# EAGLE design Freescale_Dev_2G (EAGLE 5.08)
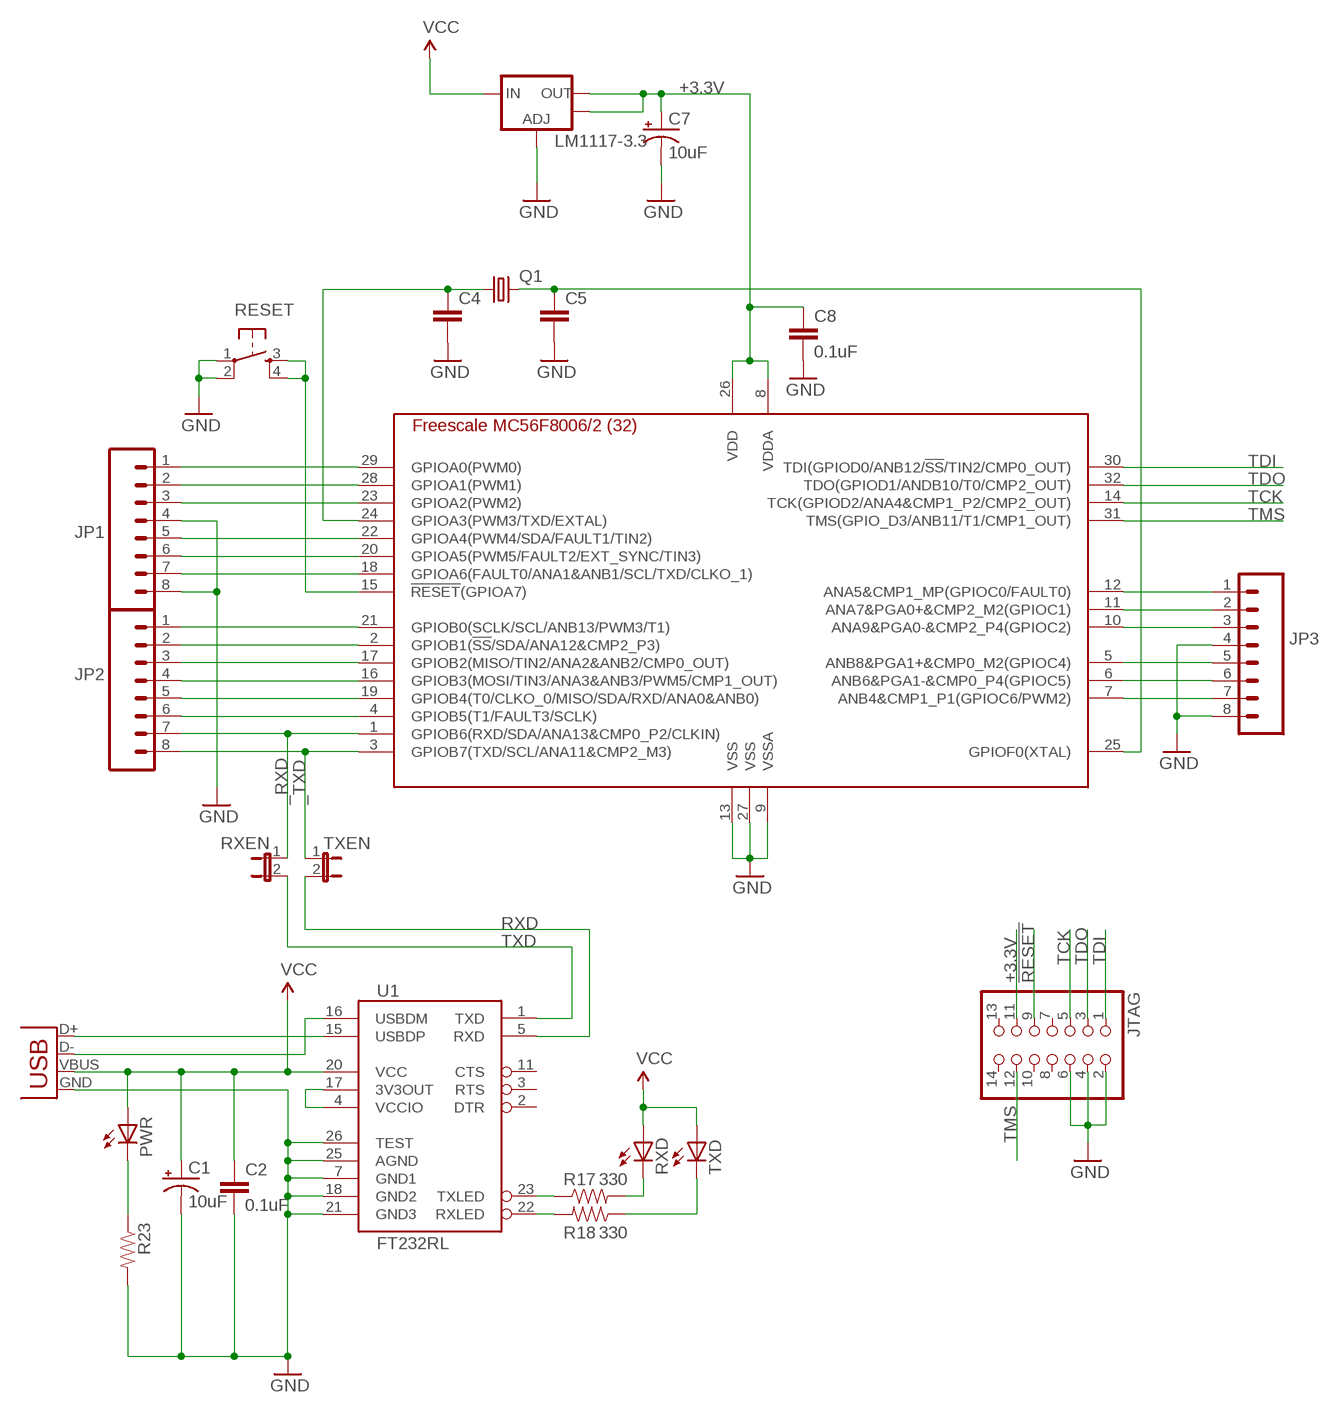
[diagram p0: schematic, sheet 1]

## Parts
C1  10uF  CAP_POL1206  [EIA3216]
C2  0.1uF  CAP0603-CAP  [0603-CAP]
C4  CAP0805  [0805]
C5  CAP0805  [0805]
C7  10uF  CAP_POL1206  [EIA3216]
C8  0.1uF  CAP0603-CAP  [0603-CAP]
JP1  M08LOCK  [1X08_LOCK]
JP2  M08LOCK  [1X08_LOCK]
JP3  M08LOCK  [1X08_LOCK]
JTAG  PINHD-2X7  [2X07]
LM1117-3.3  V_REG_LM1117SOT223  [SOT223]
PWR  LED1206  [LED-1206]
Q1  CRYSTALHC49UV  [HC49U-V]
R17  330  RESISTOR  [0805]
R18  330  RESISTOR  [0805]
R23  RESISTOR  [0805]
RESET  TAC_SWITCHPTH  [TACTILE-PTH]
RXD  LED1206  [LED-1206]
RXEN  JUMPER-2PTH_LOCK  [1X02_LOCK]
TXD  LED1206  [LED-1206]
TXEN  JUMPER-2PTH_LOCK  [1X02_LOCK]
U1  FT232RL  FT232RL-BASICSSOP  [SSOP28DB]
U$1  MC56F8006VLC  [TQFP32-08]
X1  USBSMD  [USB-MINIB]

## Nets
!RESET: JTAG.9 RESET.3 RESET.4 U$1.15(!RESET!(GPIOA7))
+3.3V: C7.A(+) C8.1 JTAG.11 LM1117-3.3.2(OUT) LM1117-3.3.4(OUT) U$1.8(VDDA) U$1.26(VDD)
_RXD: JP2.7 RXEN.1 U$1.1(GPIOB6(RXD/SDA/ANA13&CMP0_P2/CLKIN))
_TXD: JP2.8 TXEN.1 U$1.3(GPIOB7(TXD/SCL/ANA11&CMP2_M3))
GND: C1.C(-) C2.2 C4.2 C5.2 C7.C(-) C8.2 JP1.4 JP1.8 JP3.4 JP3.8 JTAG.2 JTAG.4 JTAG.6 LM1117-3.3.1(ADJ) R23.2 RESET.1 RESET.2 U1.7(GND1) U1.18(GND2) U1.21(GND3) U1.25(AGND) U1.26(TEST) U$1.9(VSSA) U$1.13(VSS) U$1.27(VSS) X1.GND
HSYNC: JP3.1 U$1.12(ANA5&CMP1_MP(GPIOC0/FAULT0))
N$9: JP1.7 U$1.18(GPIOA6(FAULT0/ANA1&ANB1/SCL/TXD/CLKO_1))
N$12: PWR.C R23.1
N$13: JP3.3 U$1.10(ANA9&PGA0-&CMP2_P4(GPIOC2))
N$14: JP3.6 U$1.6(ANB6&PGA1-&CMP0_P4(GPIOC5))
N$15: JP3.5 U$1.5(ANB8&PGA1+&CMP0_M2(GPIOC4))
N$16: JP2.5 U$1.19(GPIOB4(T0/CLKO_0/MISO/SDA/RXD/ANA0&ANB0))
N$17: JP2.6 U$1.4(GPIOB5(T1/FAULT3/SCLK))
N$20: JP1.1 U$1.29(GPIOA0(PWM0))
N$21: JP1.2 U$1.28(GPIOA1(PWM1))
N$27: JP2.1 U$1.21(GPIOB0(SCLK/SCL/ANB13/PWM3/T1))
N$28: JP2.2 U$1.2(GPIOB1(!SS!/SDA/ANA12&CMP2_P3))
N$29: JP2.3 U$1.17(GPIOB2(MISO/TIN2/ANA2&ANB2/CMP0_OUT))
N$30: JP2.4 U$1.16(GPIOB3(MOSI/TIN3/ANA3&ANB3/PWM5/CMP1_OUT))
N$32: C5.1 Q1.2 U$1.25(GPIOF0(XTAL))
N$38: R17.2 RXD.C
N$39: R18.1 TXD.C
N$40: R17.1 U1.23(TXLED)
N$41: R18.2 U1.22(RXLED)
N$42: U1.4(VCCIO) U1.17(3V3OUT)
N$43: U1.16(USBDM) X1.D-
N$44: U1.15(USBDP) X1.D+
N$48: JP1.3 U$1.23(GPIOA2(PWM2))
N$49: JP3.7 U$1.7(ANB4&CMP1_P1(GPIOC6/PWM2))
N$50: C4.1 Q1.1 U$1.24(GPIOA3(PWM3/TXD/EXTAL))
N$51: JP1.5 U$1.22(GPIOA4(PWM4/SDA/FAULT1/TIN2))
N$52: JP1.6 U$1.20(GPIOA5(PWM5/FAULT2/EXT_SYNC/TIN3))
RXD: TXEN.2 U1.5(RXD)
TCK: JTAG.5 U$1.14(TCK(GPIOD2/ANA4&CMP1_P2/CMP2_OUT))
TDI: JTAG.1 U$1.30(TDI(GPIOD0/ANB12/!SS!/TIN2/CMP0_OUT))
TDO: JTAG.3 U$1.32(TDO(GPIOD1/ANDB10/T0/CMP2_OUT))
TMS: JTAG.12 U$1.31(TMS(GPIO_D3/ANB11/T1/CMP1_OUT))
TXD: RXEN.2 U1.1(TXD)
VCC: C1.A(+) C2.1 LM1117-3.3.3(IN) PWR.A RXD.A TXD.A U1.20(VCC) X1.VBUS
VSYNC: JP3.2 U$1.11(ANA7&PGA0+&CMP2_M2(GPIOC1))
Unconnected: JTAG.7 JTAG.8 JTAG.10 JTAG.13 JTAG.14 U1.2(DTR) U1.3(RTS) U1.11(CTS)

## Library data of the parts
C1 C7 = SparkFun:CAP_POL: Capacitor Polarized These are standard SMD and PTH capacitors. Normally 10uF, 47uF, and 100uF in electrolytic and tantalum varieties. Always verify the external diameter of the through hole cap, it varies with capacity, voltage, and manufacturer. The EIA devices should be standard.
C2 C4 C5 C8 = SparkFun:CAP: Capacitor Standard 0603 ceramic capacitor, and 0.1" leaded capacitor.
JP1-JP3 = SparkFun:M08: Header 8 Standard 8-pin 0.1" header. Use with straight break away headers (SKU : PRT-00116), right angle break away headers (PRT-00553), swiss pins (PRT-00743), machine pins (PRT-00117), and female headers (PRT-00115).
JTAG = pinhead:PINHD-2X7: PIN HEADER
LM1117-3.3 = SparkFun:V_REG_LM1117: Voltage Regulator LM1117 Standard adjustable voltage regulator but in SMD form. Spark Fun Electronics SKU : COM-00595
PWR RXD TXD = SparkFun:LED: LEDs Standard schematic elements and footprints for 5mm, 3mm, 1206, and 0603 sized LEDs. 5mm - Spark Fun Electronics SKU : COM-00529 (and others)
Q1 = SparkFun:CRYSTAL: Crystals Various standard crystals. Proven footprints. Spark Fun Electronics SKU : COM-00534
R17 R18 R23 = SparkFun:RESISTOR: Resistor Basic schematic elements and footprints for 0603, 1206, and PTH 1/10th watt (small) resistors.
RESET = SparkFun:TAC_SWITCH: Momentary Switch Button commonly used for reset or general input. Spark Fun Electronics SKU : COM-00097
RXEN TXEN = SparkFun:JUMPER-2: Jumper Basic 0.1" spaced jumper. Use with breakaway headers.
U1 = SparkFun:FT232RL-BASIC: USB UART This is the simplified version of the FT232RL unit. Only what you need, nothing you don't. Spark Fun Electronics SKU : COM-00650
U$1 = Atari:MC56F8006VLC: MC56F800x: MC56F8006 and MCF56F8002 Digital Signal Controllers <https://www.freescale.com/webapp/sps/site/prod_summary.jsp?code=MC56F800x> The devices in the MC56F8006 series are members of Freescale's family of digital signal controllers (DSCs). The entry-level MC56F8006/2 DSC provides the most cost-optimized solution for mathematically-intensive, power-sensitive real-time control applications.
X1 = SparkFun:USB: USB Connectors USB-B-PTH is fully proven SKU : PRT-00139 USB-miniB is fully proven SKU : PRT-00587 USB-A-PCB is untested. USB-A-H is throughly reviewed, but untested. Spark Fun Electronics SKU : PRT-00437 USB-B-SMT is throughly reviewed, but untested. Needs silkscreen touching up. USB-A-S has not been used/tested USB-MB-H has not been used/tested

## Board
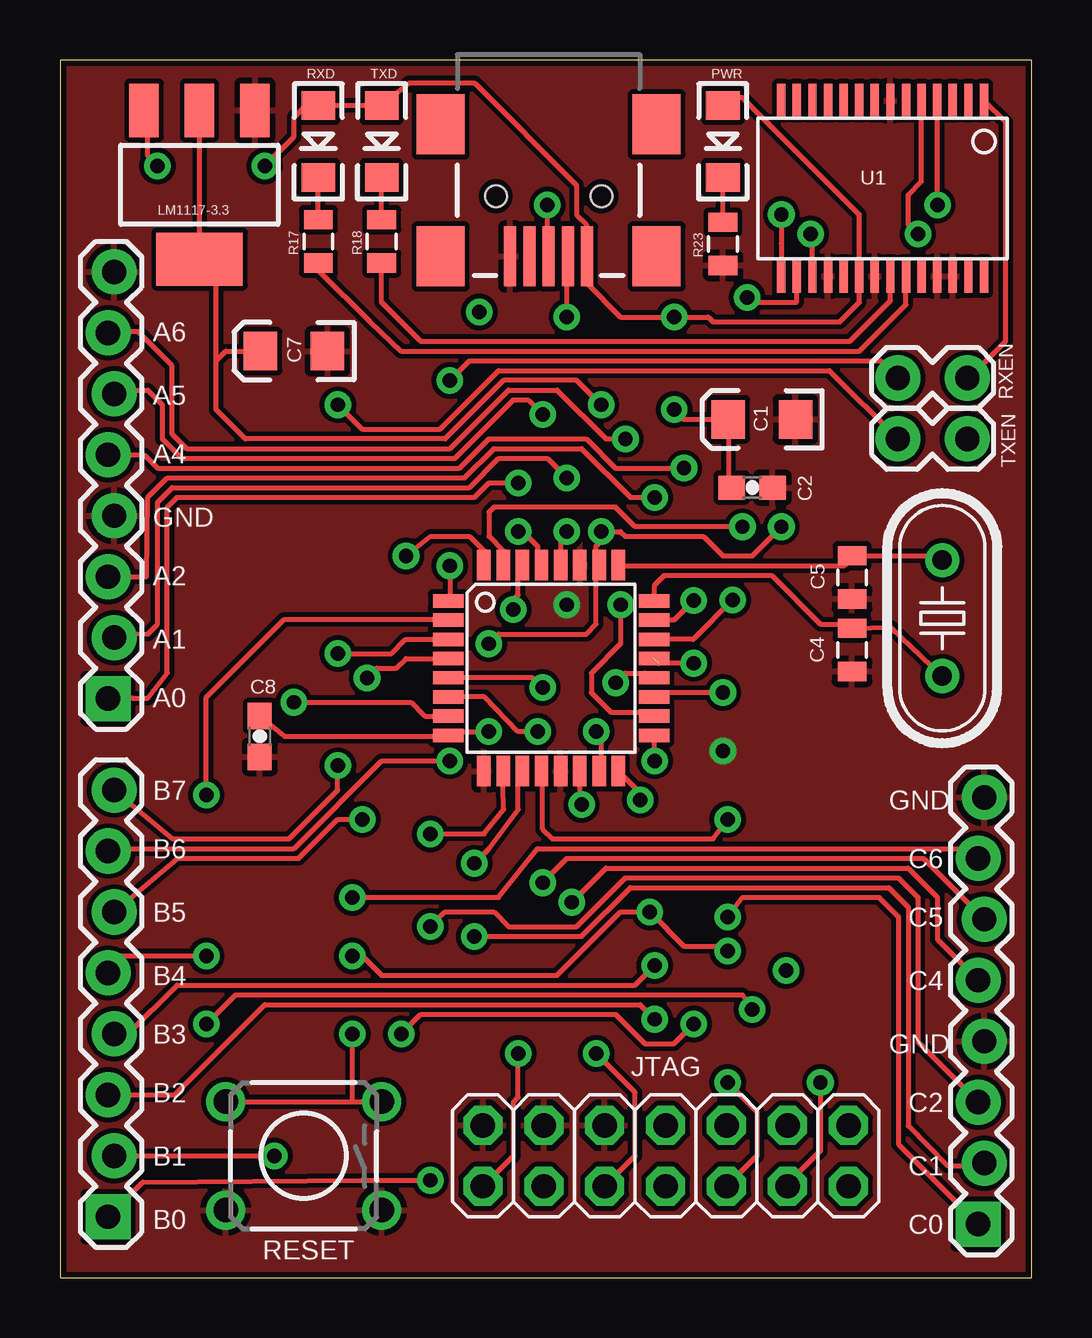
[diagram p1: board, top side]
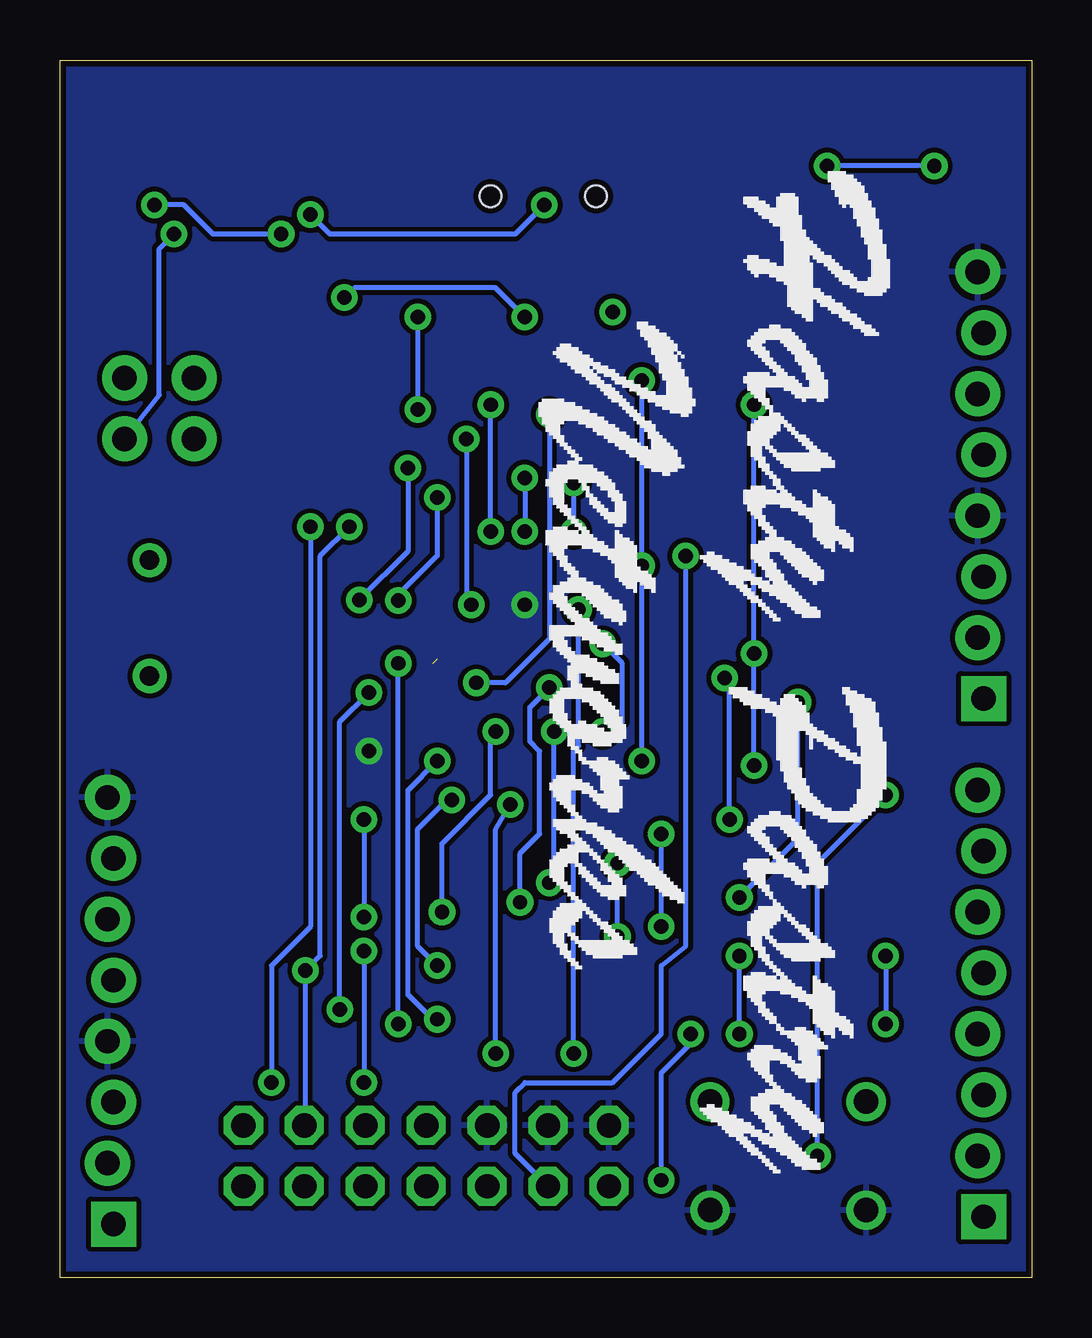
[diagram p2: board, bottom side, seen from below]

Size 40.51 x 50.74 mm. Coordinates in mm from the lower left corner, seen from the top.
Outline: 0,0 40.51,0 40.51,50.74 0,50.74 0,0
Copper layers (1*16): Top 0.035mm / dielectric 1.5mm / Bottom 0.035mm
Design rules "SparkFun": minimum track width 8mil, minimum drill 20mil, track to track 8mil, track to pad 8mil, pad to pad 8mil, via to via 8mil, smd to smd 8mil, copper to edge 10mil, drill to drill 8mil, minimum pad ring 12mil, minimum via ring 10mil, stop-mask expansion 4mil, vias tented up to drill 25mil, thermal gap 10mil

### Footprints (pad centres in the part's own frame; a part is rotated, then mirrored left to right if it is on the bottom)
EIA3216 = smd 1.4 x 1.6: A 1.4,0; C -1.4,0
0603-CAP = smd 1.1 x 1: 1 -0.85,0; 2 0.85,0
0805 = smd 0.8 x 1.2: 1 -0.9,0; 2 0.9,0
1X08_LOCK = drill 1.016 pad 1.88 square: 1 0,0.127 | drill 1.016 pad 1.88 round: 2 2.54,-0.127; 3 5.08,0.127; 4 7.62,-0.127; 5 10.16,0.127; 6 12.7,-0.127; 7 15.24,0.127; 8 17.78,-0.127
2X07 = drill 1.016 octagon: 1 -7.62,-1.27; 2 -7.62,1.27; 3 -5.08,-1.27; 4 -5.08,1.27; 5 -2.54,-1.27; 6 -2.54,1.27; 7 0,-1.27; 8 0,1.27; 9 2.54,-1.27; 10 2.54,1.27; 11 5.08,-1.27; 12 5.08,1.27; 13 7.62,-1.27; 14 7.62,1.27
SOT223 = smd 1.219 x 2.235: 1 -2.311,-3.099; 2 0,-3.099; 3 2.311,-3.099 | smd 3.6 x 2.2: 4 0,3.099
LED-1206 = smd 1.2 x 1.4: A -1.5,0; C 1.5,0
HC49U-V = drill 0.813 round: 1 -2.413,0; 2 2.413,0
TACTILE-PTH = drill 1.016 round: 1 -3.251,2.261; 2 3.251,2.261; 3 -3.251,-2.261; 4 3.251,-2.261
1X02_LOCK = drill 1.016 pad 1.88 round: 1 -0.178,0; 2 2.718,0
SSOP28DB = smd 0.348 x 1.397: 1 -4.225,-3.656; 2 -3.575,-3.656; 3 -2.925,-3.656; 4 -2.275,-3.656; 5 -1.625,-3.656; 6 -0.975,-3.656; 7 -0.325,-3.656; 8 0.325,-3.656; 9 0.975,-3.656; 10 1.625,-3.656; 11 2.275,-3.656; 12 2.925,-3.656; 13 3.575,-3.656; 14 4.225,-3.656; 15 4.225,3.656; 16 3.575,3.656; 17 2.925,3.656; 18 2.275,3.656; 19 1.625,3.656; 20 0.975,3.656; 21 0.325,3.656; 22 -0.325,3.656; 23 -0.975,3.656; 24 -1.625,3.656; 25 -2.275,3.656; 26 -2.925,3.656; 27 -3.575,3.656; 28 -4.225,3.656
TQFP32-08 = smd 1.27 x 0.559: 1 -4.293,2.8; 2 -4.293,2; 3 -4.293,1.2; 4 -4.293,0.4; 5 -4.293,-0.4; 6 -4.293,-1.2; 7 -4.293,-2; 8 -4.293,-2.8; 17 4.293,-2.8; 18 4.293,-2; 19 4.293,-1.2; 20 4.293,-0.4; 21 4.293,0.4; 22 4.293,1.2; 23 4.293,2; 24 4.293,2.8 | smd 0.559 x 1.27: 9 -2.8,-4.293; 10 -2,-4.293; 11 -1.2,-4.293; 12 -0.4,-4.293; 13 0.4,-4.293; 14 1.2,-4.293; 15 2,-4.293; 16 2.8,-4.293; 25 2.8,4.293; 26 2,4.293; 27 1.2,4.293; 28 0.4,4.293; 29 -0.4,4.293; 30 -1.2,4.293; 31 -2,4.293; 32 -2.8,4.293
USB-MINIB = smd 2.5 x 0.5: D+ 2.5,0; D- 2.5,0.8; GND 2.5,-1.6; ID 2.5,-0.8; VBUS 2.5,1.6 | smd 2.5 x 2: GND@1 -3,-4.5; GND@2 -3,4.5; GND@3 2.5,4.5; GND@4 2.5,-4.5 | hole 0.9: 0,2.2; 0,-2.2

### Placement (x,y rotation side)
C1  29.26,35.76 180 top
C2  28.85,32.92 0 top
C4  33.02,26.16 270 top
C5  33.02,29.18 270 top
C7  9.75,38.61 180 top
C8  8.33,22.56 270 top
JP1  2.13,24.13 90 top
JP2  2.13,2.54 90 top
JP3  38.4,2.24 90 top
JTAG  25.25,5.08 0 top
LM1117-3.3  5.82,45.54 180 top
PWR  27.64,47.35 270 top
Q1  36.78,27.48 90 top
R17  10.77,43.18 90 top
R18  13.41,43.18 270 top
R23  27.64,43.08 270 top
RESET  10.16,5.08 180 top
RXD  10.77,47.35 270 top
RXEN  35.1,37.49 0 top
TXD  13.41,47.35 270 top
TXEN  35.1,34.95 0 top
U1  34.29,45.39 180 top
U$1  20.47,25.4 0 top
U$2  [HP_LOGO_SM]  13.82,24.79 270 bottom
X1  20.37,45.06 270 top

### Tracks (layer width: path | path; a pad name or v marks a point on that pad's centre or on a via)
!RESET  (via drill 0.6)
  Top 0.203: RESET.4 12.19,7.34 | 12.19,7.34 RESET.3 | U$1.15 22.55,21.23 22.55,22.55 v22.35,22.76 | v12.19,13.41 12.6,13.41 13.41,12.6 20.73,12.6 23.37,15.24 v24.59,15.24 26.01,13.82 27.64,13.82 v27.84,13.61 | 12.19,7.34 v12.19,10.16 | JTAG.9 29.06,5.08 29.06,6.91 v27.84,8.13
  Bottom 0.203: v22.35,22.76 22.55,22.55 22.55,20.12 24.59,18.09 v24.59,15.24 | v12.19,10.16 v12.19,13.41 | v27.84,13.61 v27.84,8.13
+3.3V  (via drill 0.6)
  Top 0.203: v17.88,26.42 18.29,26.82 21.95,26.82 22.35,27.23 22.35,29.67 U$1.26 22.35,29.81 22.35,30.48 22.55,30.68 v22.55,31.09 23.37,31.09 23.57,30.89 26.82,30.89 27.64,30.07 28.85,30.07 v30.07,31.29 | LM1117-3.3.2 LM1117-3.3.4 6.4,41.86 6.5,41.86 6.5,38.2 | v22.55,36.37 21.54,37.39 18.49,37.39 16.05,34.95 7.72,34.95 6.5,36.17 6.5,38.2 | v17.88,22.76 16.26,22.76 U$1.8 arc-90 16.14,22.55 9.35,22.55 C8.1 | C7.A 6.91,38.61 6.5,38.2 | JTAG.11 30.33,3.91 31.7,5.28 v31.7,8.13
  Bottom 0.203: v17.88,22.76 17.48,22.76 17.07,23.16 17.07,25.6 v17.88,26.42 | v22.55,31.09 v22.55,36.37 | v30.07,31.29 30.07,14.63 31.7,13.01 v31.7,8.13
_RXD  (via drill 0.6)
  Top 0.203: JP2.7 2.52,17.88 9.75,17.88 13.41,21.54 v16.26,21.54 | 16.26,28.28 U$1.1 16.02,28.2 16.26,28.37 v16.26,29.67 | v16.26,37.39 17.07,38.2 34.21,38.2 RXEN.1
  Bottom 0.203: v16.26,21.54 v16.26,29.67 v16.26,37.39
_TXD  (via drill 0.6)
  Top 0.203: v11.58,26.01 13.82,26.01 14.41,26.6 U$1.3 | JP2.8 4.7,18.29 9.55,18.29 11.58,20.32 v11.58,21.34 | TXEN.1 32.08,37.8 18.29,37.8 15.85,35.36 12.6,35.36 v11.58,36.37
  Bottom 0.203: v11.58,21.34 v11.58,26.01 v11.58,36.37
GND  (via drill 0.6)
  other vias: 21.13,28.04 27.64,21.95
  pour Top: 0,50.55 40.44,50.55 40.44,0 0,0
  pour Bottom: 0.41,50.8 40.64,50.8 40.64,0 0,0 0,50.8
HSYNC  (via drill 0.6)
  Top 0.203: JP3.1 34.95,5.56 34.95,15.04 34.14,15.85 28.45,15.85 v27.84,15.04 | v27.84,19.1 27.23,18.29 20.52,18.29 20.12,18.69 20.12,21.06 U$1.12
  Bottom 0.203: v27.84,19.1 v27.84,15.04
N$4  (via drill 0.6)
  other vias: 17.48,40.23
N$9  (via drill 0.6)
  Top 0.203: JP1.7 2.44,39.42 3.25,39.42 4.67,38 4.67,35.15 5.28,34.54 16.26,34.54 18.69,36.98 20.73,36.98 22.76,34.95 v23.57,34.95 | U$1.18 24.38,23.57 22.96,23.57 22.15,24.38 22.15,25.2 23.37,26.42 v23.37,28.04
  Bottom 0.203: v23.57,34.95 23.57,28.45 23.37,28.25 v23.37,28.04
N$12
  Top 0.203: R23.1 PWR.C
N$13  (via drill 0.6)
  Top 0.203: JP3.3 35.76,9.83 35.76,15.85 34.95,16.66 23.57,16.66 21.54,14.63 18.69,14.63 18.09,15.24 16.05,15.24 v15.44,14.63 | U$1.10 18.47,20.5 18.49,19.51 17.68,18.49 v15.44,18.49
  Bottom 0.203: v15.44,14.63 v15.44,18.49
N$14  (via drill 0.6)
  Top 0.203: U$1.6 17.7,24.2 19.1,22.76 v19.91,22.76 | JP3.6 35.99,17.48 21.13,17.48 v20.12,16.46
  Bottom 0.203: v20.12,16.46 19.91,16.66 v19.91,22.76
N$15  (via drill 0.6)
  Top 0.203: U$1.5 17.67,25 19.71,24.99 v20.12,24.59 | JP3.5 36.58,14.1 36.58,15.85 35.36,17.07 22.76,17.07 v21.34,15.65
  Bottom 0.203: v21.34,15.65 21.34,17.68 20.52,18.49 20.52,21.95 20.93,22.35 20.93,23.77 v20.12,24.59
N$16  (via drill 0.6)
  Top 0.203: U$1.19 24.95,24.38 v27.64,24.38 | v6.1,13.41 2.52,13.41 JP2.5 | v6.1,10.57 7.32,11.79 28.45,11.79 v28.85,11.18
  Bottom 0.203: v28.85,11.18 28.85,23.16 v27.64,24.38 | v6.1,13.41 v6.1,10.57
N$17  (via drill 0.6)
  Top 0.203: JP2.6 4.9,17.48 9.96,17.48 11.58,19.1 v12.6,19.1 | v12.8,24.99 13.21,25.4 14.02,25.4 14.42,25.8 U$1.4
  Bottom 0.203: v12.6,19.1 12.6,24.79 v12.8,24.99
N$20  (via drill 0.6)
  Top 0.203: JP1.1 2.44,24.38 3.02,24.16 3.66,24.16 4.47,25.2 4.47,32.11 4.88,32.51 17.27,32.51 17.88,33.12 v19.1,33.12 | v19.1,31.09 19.3,31.09 19.91,30.48 19.91,29.85 U$1.29
  Bottom 0.203: v19.1,33.12 v19.1,31.09
N$21  (via drill 0.6)
  Top 0.203: JP1.2 2.85,26.85 3.66,26.82 4.06,27.23 4.06,32.31 4.67,32.92 17.07,32.92 18.29,34.14 20.32,34.14 v21.13,33.33 | v21.13,31.09 21.13,30.89 20.87,30.63 U$1.28
  Bottom 0.203: v21.13,33.33 v21.13,31.09
N$27  (via drill 0.6)  (1 unrouted)
  Top 0.203: JP2.1 3.45,3.99 12.6,4.06 v15.44,4.06 | v14.22,10.16 15.04,10.97 23.16,10.97 24.38,9.75 25.6,9.75 v26.42,10.57 | v26.42,25.6 24.96,25.6
  Bottom 0.203: v15.44,4.06 15.44,8.53 14.22,9.75 v14.22,10.16 | v26.42,10.57 v26.42,25.6
N$28  (via drill 0.6)
  Top 0.203: JP2.2 v8.94,5.08 | v6.1,20.12 6.1,24.18 9.35,27.43 16.15,27.43 arc-90 U$1.2
  Bottom 0.203: v8.94,5.08 8.94,17.27 v6.1,20.12
N$29  (via drill 0.6)
  Top 0.203: v24.79,21.54 24.79,22.57 U$1.17 | JP2.3 4.78,7.62 8.53,11.38 24.18,11.38 v24.79,10.77
  Bottom 0.203: v24.79,10.77 25.2,10.97 26.01,11.79 26.01,20.32 v24.79,21.54
N$30  (via drill 0.6)
  Top 0.203: v24.79,13.01 23.98,12.19 4.88,12.19 2.85,10.16 JP2.4 | U$1.16 24.18,20.2 v24.18,19.91
  Bottom 0.203: v24.79,13.01 25.6,13.82 25.6,18.69 24.38,19.91 v24.18,19.91
N$32
  Top 0.203: U$1.25 23.3,29.67 32.72,29.67 33.11,30.07 C5.1 36.59,30.09 Q1.2
N$38
  Top 0.203: R17.2 RXD.C
N$39
  Top 0.203: R18.1 TXD.C
N$40
  Top 0.203: U1.23 35.27,40.55 33.33,38.61 14.22,38.61 12.92,39.83 10.77,41.98 R17.1
N$41
  Top 0.203: R18.2 13.41,40.64 15.04,39.01 32.92,39.01 34.62,40.71 U1.22
N$42  (via drill 0.6)
  Top 0.203: U1.4 36.58,49.03 v36.58,44.7 | v31.29,43.48 31.36,43.15 U1.17
  Bottom 0.203: v31.29,43.48 34.14,43.48 35.36,44.7 v36.58,44.7
N$43  (via drill 0.6)
  Top 0.203: v21.13,40.03 21.13,42.52 X1.D- | v28.65,40.84 28.85,40.64 30.68,40.64 30.71,40.67 U1.16
  Bottom 0.203: v21.13,40.03 22.35,41.25 28.25,41.25 v28.65,40.84
N$44  (via drill 0.6)
  Top 0.203: v20.32,44.7 20.32,42.51 X1.D+ | v30.07,44.3 30.07,43.09 U1.15
  Bottom 0.203: v20.32,44.7 21.54,43.48 29.26,43.48 v30.07,44.3
N$48  (via drill 0.6)
  Top 0.203: v24.79,32.51 23.77,32.51 21.74,34.54 18.09,34.54 16.87,33.33 4.47,33.33 3.66,32.51 3.61,29.21 JP1.3 | U$1.23 25.6,27.4 v26.42,28.21
  Bottom 0.203: v24.79,32.51 24.79,30.07 26.42,28.45 v26.42,28.21
N$49  (via drill 0.6)
  Top 0.203: U$1.7 15.21,23.4 14.63,23.98 v9.75,23.98 | v12.19,15.85 18.29,15.85 19.91,17.88 37.87,17.88 JP3.7
  Bottom 0.203: v9.75,23.98 9.75,18.29 v12.19,15.85
N$50
  Top 0.203: U$1.24 24.79,28.23 24.79,28.85 25.2,29.26 29.67,29.26 31.7,27.23 32.88,27.23 C4.1 34.63,27.1 Q1.1
N$51  (via drill 0.6)
  Top 0.203: v26.01,33.73 23.16,33.73 21.95,34.95 17.88,34.95 16.66,33.73 4.06,33.73 3.5,34.29 JP1.5 | v28.04,28.25 26.4,26.6 U$1.22
  Bottom 0.203: v26.01,33.73 26.01,30.28 v28.04,28.25
N$52  (via drill 0.6)
  Top 0.203: v20.12,35.97 19.51,36.58 18.9,36.58 16.46,34.14 5.08,34.14 4.27,34.95 4.27,36.37 3.66,36.98 2.85,36.98 JP1.6 | v23.16,24.79 23.57,25.2 24.38,25.2 U$1.20
  Bottom 0.203: v20.12,35.97 20.12,26.62 21.95,24.79 v23.16,24.79
RXD  (via drill 0.6)
  Top 0.203: U1.5 35.91,45.67 35.36,45.11 35.36,43.89 v35.76,43.48
  Bottom 0.203: TXEN.2 36.37,36.78 36.37,42.88 v35.76,43.48
TCK  (via drill 0.6)
  Top 0.203: U$1.14 21.67,19.78 v21.74,19.71 | v22.35,9.35 23.98,7.72 23.98,5.08 JTAG.5
  Bottom 0.203: v21.74,19.71 22.35,18.69 v22.35,9.35
TDI  (via drill 0.6)
  Top 0.203: U$1.30 19.1,29.52 19.1,28.45 18.9,28.25 v18.9,27.84 | v19.1,9.35 19.1,7.52 18.9,7.32 18.9,5.08 JTAG.1
  Bottom 0.203: v18.9,27.84 18.9,22.15 19.1,21.95 v19.1,9.35
TDO  (via drill 0.6)
  Top 0.203: U$1.32 17.67,30.28 17.07,30.89 15.44,30.89 v14.43,30.07
  Bottom 0.203: v14.43,30.07 14.43,13.82 15.44,13.01 15.44,10.16 17.48,8.13 21.13,8.13 21.54,7.72 21.54,5.18 JTAG.3
TMS  (via drill 0.6)
  Top 0.203: U$1.31 18.47,30.3 17.88,30.89 17.88,31.9 18.09,32.11 23.16,32.11 23.98,31.29 v28.45,31.29
  Bottom 0.203: v28.45,31.29 29.67,30.07 29.67,13.41 30.07,13.01 v30.28,12.8 30.28,6.4 JTAG.12
TXD
  Top 0.203: U1.1 39.42,48.14 39.42,39.01 38.51,38.1 RXEN.2
VCC  (via drill 0.6)
  Top 0.203: LM1117-3.3.3 3.66,48.49 3.66,46.74 v4.06,46.33 | v8.53,46.33 9.75,47.55 9.75,48.36 10.54,49.15 RXD.A TXD.A 14.55,49.78 17.27,49.78 21.54,45.52 21.54,44.3 21.95,43.89 21.95,42.53 | PWR.A 27.64,49.17 28.45,49.17 33.33,44.3 33.33,41.74 U1.20 33.33,41.72 33.33,40.64 32.51,39.83 27.23,39.83 27.03,40.03 v25.6,40.03 23.37,40.03 21.95,41.45 21.95,42.53 | v25.6,36.17 26.01,35.76 C1.A 27.86,33.06 C2.1 | 21.95,42.53 X1.VBUS
  Bottom 0.203: v4.06,46.33 v8.53,46.33 | v25.6,40.03 v25.6,36.17
VSYNC  (via drill 0.6)
  Top 0.203: JP3.2 38.43,4.67 36.98,4.67 35.36,6.33 35.36,15.44 34.54,16.26 23.77,16.26 21.74,14.22 v17.27,14.22 | v17.27,17.27 17.88,17.88 19.1,19.51 19.1,20.73 19.27,20.9 U$1.11
  Bottom 0.203: v17.27,14.22 v17.27,17.27

### Text on the board
tPlace: A6 | A5 | A4 | GND | A2 | A1 | A0 | B7 | GND | B6 | C6 | B5 | C5 | B4 | C4 | B3 | GND | B2 | C2 | B1 | C1 | B0 | C0